# EAGLE schematic Memory_Card (EAGLE 9.4.0)
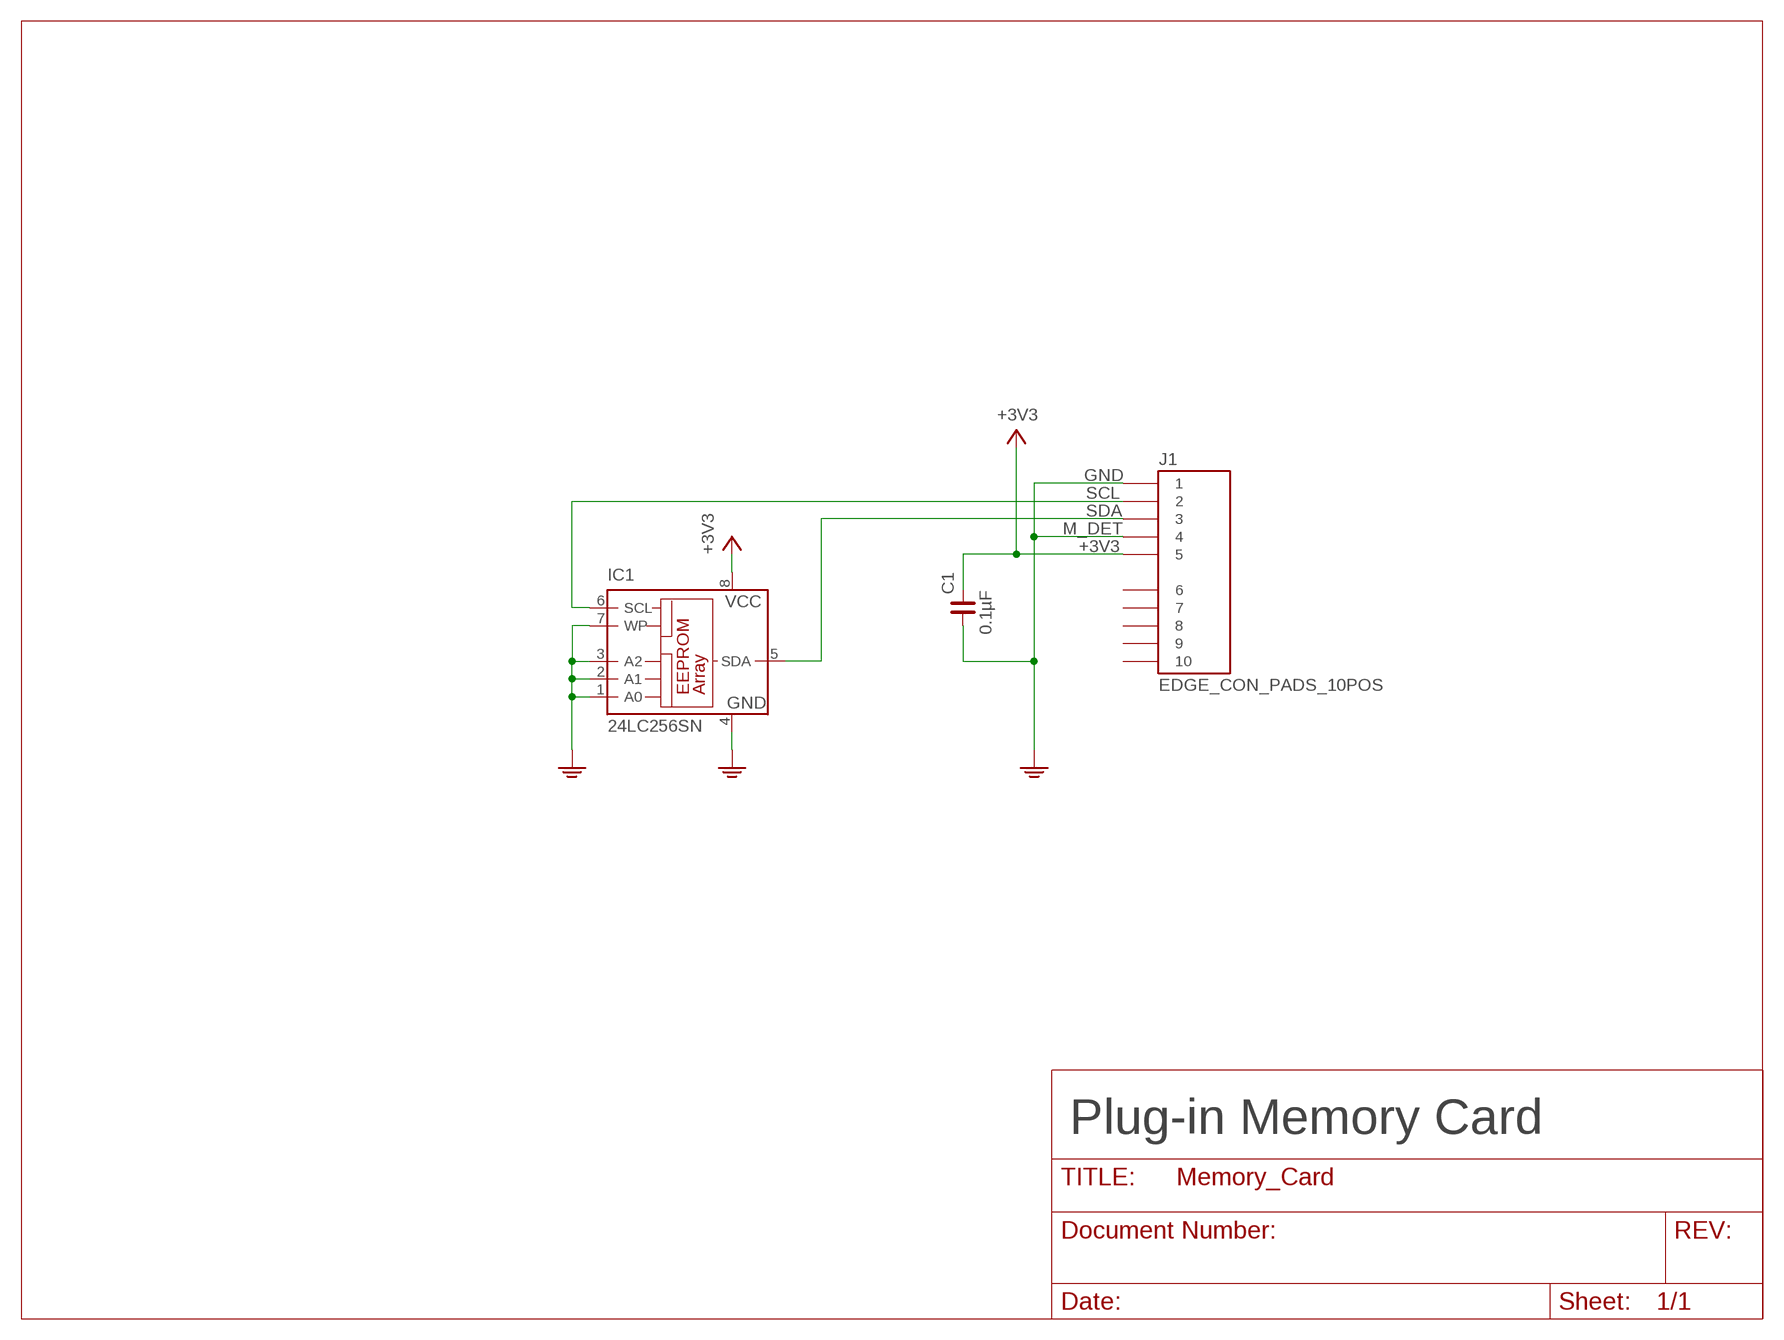
[diagram p0: schematic, sheet 1]

## Parts
C1  0.1µF  C_0603  [C0603]
IC1  24LC256SN  [SO-08]
J1  EDGE_CON_PADS_10POS  [EDGE_CON_PADS]

## Nets
+3V3: C1.2 IC1.8(VCC) J1.5
GND: C1.1 IC1.1(A0) IC1.2(A1) IC1.3(A2) IC1.4(GND) IC1.7(WP) J1.1 J1.4
SCL: IC1.6(SCL) J1.2
SDA: IC1.5(SDA) J1.3
Unconnected: J1.6 J1.7 J1.8 J1.9 J1.10

## Notes on the sheet
- M_DET
- Plug-in Memory Card

## Library data of the parts
C1 = xavier:C_: NON-POLARIZED CAP
IC1 = microchip:24*: Serial EEPROM I2C; MF: MICROCHIP; MPN: 24LC256-I/SN; OC_FARNELL: 9757996; OC_NEWARK: 27C9144
J1 = xavier:EDGE_CON_PADS_10POS: 44 PIN EDGE CONNECTOR FOR PCB